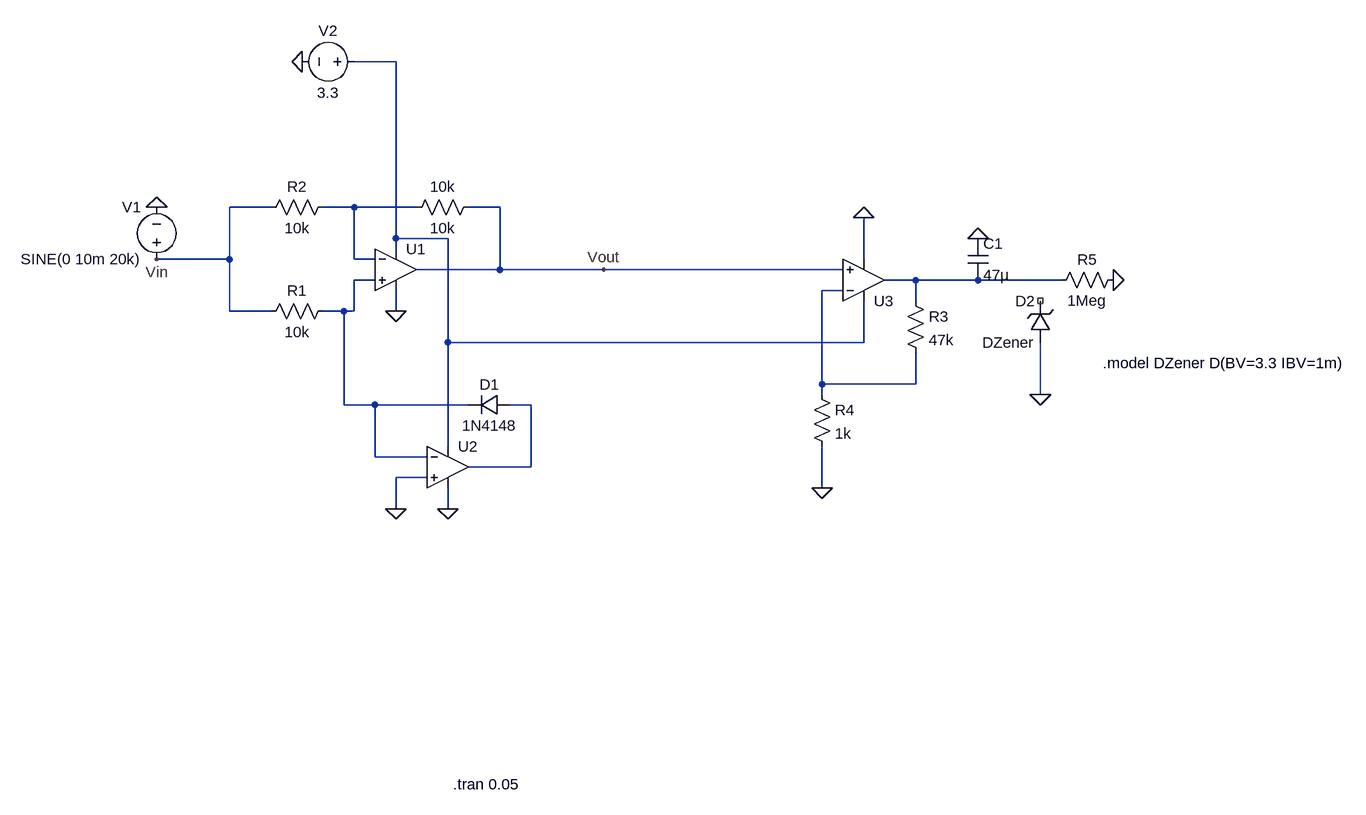
[diagram p0: schematic Draft4.asc]
Draft4.asc, the LTspice schematic file:
Version 4.1
SHEET 1 2516 728
WIRE 400 -400 336 -400
WIRE 208 -176 144 -176
WIRE 336 -176 288 -176
WIRE 432 -176 336 -176
WIRE 560 -176 512 -176
WIRE 400 -128 400 -400
WIRE 480 -128 400 -128
WIRE 400 -112 400 -128
WIRE 144 -96 144 -176
WIRE 144 -96 32 -96
WIRE 336 -96 336 -176
WIRE 368 -96 336 -96
WIRE 1120 -96 1120 -160
WIRE 560 -80 560 -176
WIRE 560 -80 432 -80
WIRE 720 -80 560 -80
WIRE 1088 -80 720 -80
WIRE 368 -64 336 -64
WIRE 1200 -64 1152 -64
WIRE 1296 -64 1200 -64
WIRE 1424 -64 1296 -64
WIRE 1088 -48 1056 -48
WIRE 1200 -32 1200 -64
WIRE 144 -16 144 -96
WIRE 208 -16 144 -16
WIRE 320 -16 288 -16
WIRE 336 -16 336 -64
WIRE 336 -16 320 -16
WIRE 400 -16 400 -48
WIRE 480 32 480 -128
WIRE 1120 32 1120 -32
WIRE 1120 32 480 32
WIRE 1056 96 1056 -48
WIRE 1200 96 1200 48
WIRE 1200 96 1056 96
WIRE 1056 112 1056 96
WIRE 1392 112 1392 32
WIRE 320 128 320 -16
WIRE 368 128 320 128
WIRE 512 128 368 128
WIRE 608 128 576 128
WIRE 480 192 480 32
WIRE 368 208 368 128
WIRE 448 208 368 208
WIRE 608 224 608 128
WIRE 608 224 512 224
WIRE 448 240 400 240
WIRE 1056 256 1056 192
WIRE 400 288 400 240
WIRE 480 288 480 256
FLAG 400 -16 0
FLAG 400 288 0
FLAG 480 288 0
FLAG 256 -400 0
FLAG 1120 -160 0
FLAG 1056 256 0
FLAG 1296 -128 0
FLAG 1504 -64 0
FLAG 1392 112 0
FLAG 720 -80 Vout
FLAG 32 -96 Vin
FLAG 32 -176 0
SYMBOL res 304 -32 R90
WINDOW 0 0 56 VBottom 2
WINDOW 3 32 56 VTop 2
SYMATTR InstName R1
SYMATTR Value 10k
SYMBOL res 304 -192 R90
WINDOW 0 0 56 VBottom 2
WINDOW 3 32 56 VTop 2
SYMATTR InstName R2
SYMATTR Value 10k
SYMBOL OpAmps\\UniversalOpAmp2 400 -80 R0
SYMATTR InstName U1
SYMBOL res 528 -192 R90
WINDOW 0 0 56 VBottom 2
WINDOW 3 32 56 VTop 2
SYMATTR InstName 10k
SYMATTR Value 10k
SYMBOL OpAmps\\UniversalOpAmp2 480 224 R0
SYMATTR InstName U2
SYMBOL diode 576 112 R90
WINDOW 0 0 32 VBottom 2
WINDOW 3 32 32 VTop 2
SYMATTR InstName D1
SYMATTR Value 1N4148
SYMBOL voltage 352 -400 R90
WINDOW 0 -32 56 VBottom 2
WINDOW 3 32 56 VTop 2
WINDOW 123 0 0 Left 0
WINDOW 39 0 0 Left 0
SYMATTR InstName V2
SYMATTR Value 3.3
SYMBOL OpAmps\\UniversalOpAmp2 1120 -64 M180
SYMATTR InstName U3
SYMBOL res 1184 -48 R0
SYMATTR InstName R3
SYMATTR Value 47k
SYMBOL res 1040 96 R0
SYMATTR InstName R4
SYMATTR Value 1k
SYMBOL cap 1280 -128 R0
SYMATTR InstName C1
SYMATTR Value 47µ
SYMBOL res 1520 -80 R90
WINDOW 0 0 56 VBottom 2
WINDOW 3 32 56 VTop 2
SYMATTR InstName R5
SYMATTR Value 1Meg
SYMBOL zener 1408 32 R180
WINDOW 0 24 64 Left 2
WINDOW 3 24 0 Left 2
SYMATTR InstName D2
SYMATTR Value DZener
SYMBOL voltage 32 -80 R180
WINDOW 0 24 96 Left 2
WINDOW 3 24 16 Left 2
WINDOW 123 0 0 Left 0
WINDOW 39 0 0 Left 0
SYMATTR InstName V1
SYMATTR Value SINE(0 10m 20k)
TEXT 488 712 Left 2 !.tran 0.05
TEXT 1488 64 Left 2 !.model DZener D(BV=3.3 IBV=1m)

The netlist it stands for:
* Draft4.asc
R1 N003 Vin 10k
R2 N002 Vin 10k
X§U1 N003 N002 N001 0 Vout level2 Avol=1Meg GBW=10Meg Slew=10Meg Ilimit=25m Rail=0 Vos=0 En=0 Enk=0 In=0 Ink=0 Rin=500Meg  ; pins In+ In- V+ V- OUT
R§10k Vout N002 10k
X§U2 0 N003 N001 0 N006 level2 Avol=1Meg GBW=10Meg Slew=10Meg Ilimit=25m Rail=0 Vos=0 En=0 Enk=0 In=0 Ink=0 Rin=500Meg  ; pins In+ In- V+ V- OUT
D1 N006 N003 1N4148
V2 N001 0 3.3
X§U3 Vout N005 N001 0 N004 level2 Avol=1Meg GBW=10Meg Slew=10Meg Ilimit=25m Rail=0 Vos=0 En=0 Enk=0 In=0 Ink=0 Rin=500Meg  ; pins In+ In- V+ V- OUT
R3 N004 N005 47k
R4 N005 0 1k
C1 0 N004 47µ
R5 0 N004 1Meg
D2 0 NC_01 DZener
V1 Vin 0 SINE(0 10m 20k)
.model D D
.lib standard.dio
.tran 0.05
.model DZener D(BV=3.3 IBV=1m)
.lib UniversalOpAmp2.lib
.backanno
.end